# Altium schematic sheet POWER.SchDoc
size A3
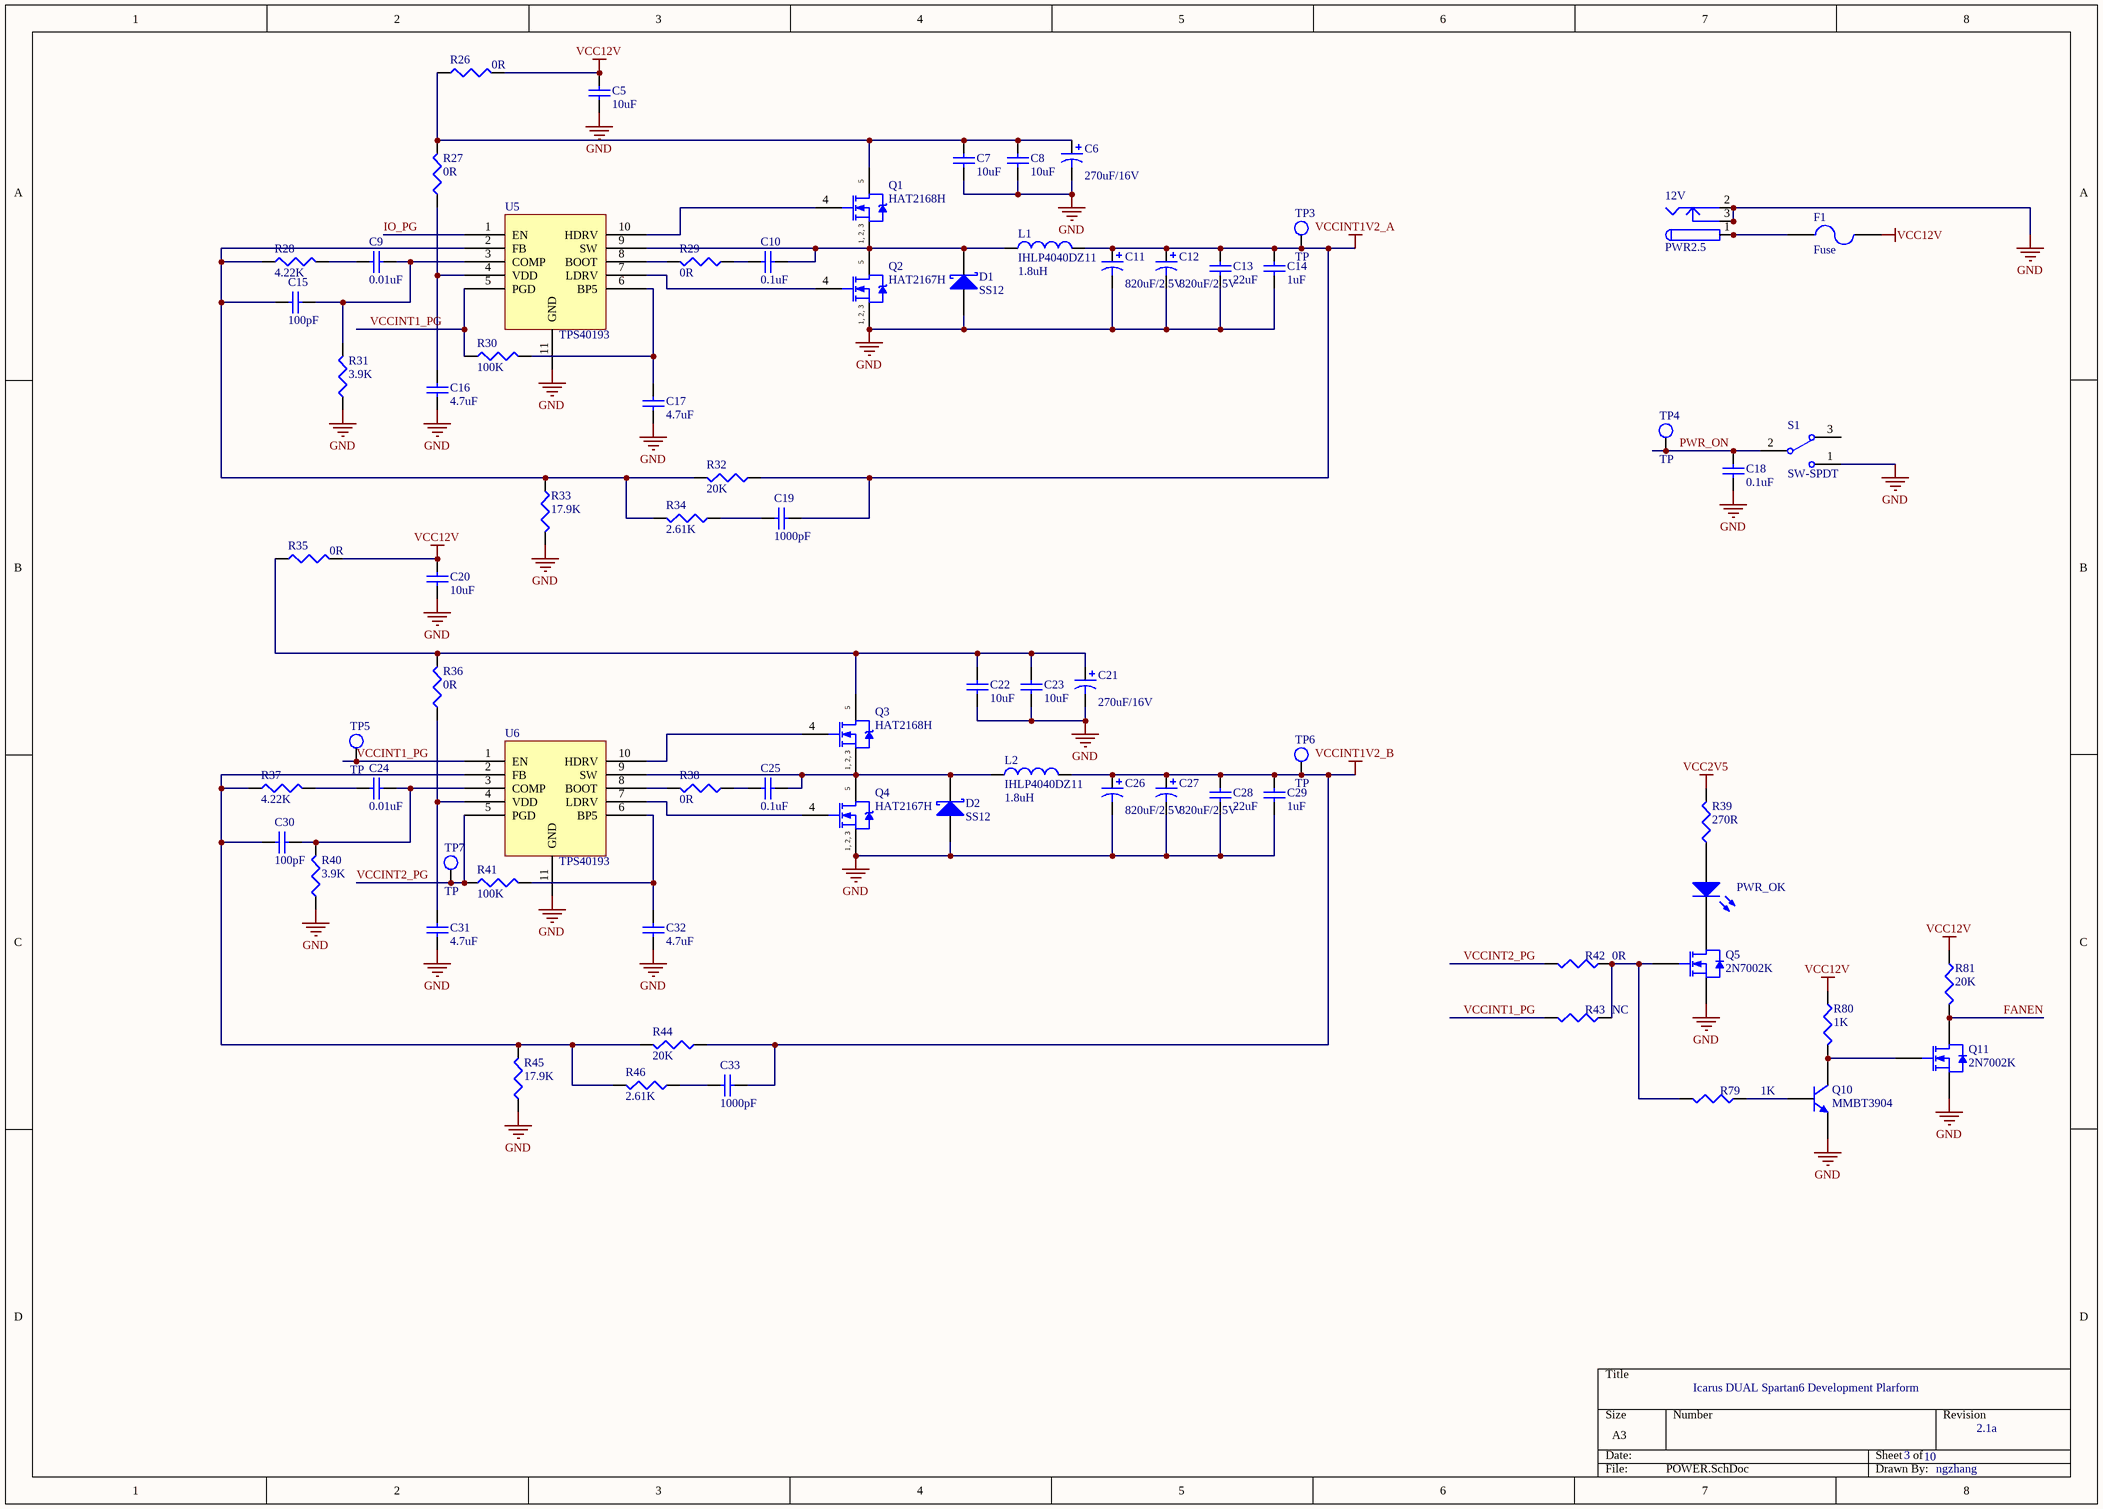
[diagram p0: POWER.SchDoc]

## Parts
12V  PWR2.5  [KLD-0202]
C5  10uF  [C1206]
C6  270uF/16V  [CAP8X8]
C7  10uF  [C1206]
C8  10uF  [C1206]
C9  0.01uF  [1608[0603]]
C10  0.1uF  [1608[0603]]
C11  820uF/2.5V  [CAP8X8]
C12  820uF/2.5V  [CAP8X8]
C13  22uF  [C1206]
C14  1uF  [1608[0603]]
C15  100pF  [1608[0603]]
C16  4.7uF  [C0805]
C17  4.7uF  [C0805]
C18  0.1uF  [1608[0603]]
C19  1000pF  [1608[0603]]
C20  10uF  [C1206]
C21  270uF/16V  [CAP8X8]
C22  10uF  [C1206]
C23  10uF  [C1206]
C24  0.01uF  [1608[0603]]
C25  0.1uF  [1608[0603]]
C26  820uF/2.5V  [CAP8X8]
C27  820uF/2.5V  [CAP8X8]
C28  22uF  [C1206]
C29  1uF  [1608[0603]]
C30  100pF  [1608[0603]]
C31  4.7uF  [C0805]
C32  4.7uF  [C0805]
C33  1000pF  [1608[0603]]
D1  SS12  [SMA]
D2  SS12  [SMA]
F1  Fuse  [12Z-2010]
L1  IHLP4040DZ11  value 1.8uH  [IHLP4040]
L2  IHLP4040DZ11  value 1.8uH  [IHLP4040]
PWR_OK  LED3  [CD1608-0603]  (value not drawn)
Q1  HAT2168H  [LFPAK]
Q2  HAT2167H  [LFPAK]
Q3  HAT2168H  [LFPAK]
Q4  HAT2167H  [LFPAK]
Q5  2N7002K  [SOT23_N]
Q10  MMBT3904  [SOT23_N]
Q11  2N7002K  [SOT23_N]
R26  0R  [C1206]
R27  0R  [J1-0603]
R28  4.22K  [J1-0603]
R29  0R  [J1-0603]
R30  100K  [J1-0603]
R31  3.9K  [J1-0603]
R32  20K  [J1-0603]
R33  17.9K  [J1-0603]
R34  2.61K  [J1-0603]
R35  0R  [C1206]
R36  0R  [J1-0603]
R37  4.22K  [J1-0603]
R38  0R  [J1-0603]
R39  270R  [J1-0603]
R40  3.9K  [J1-0603]
R41  100K  [J1-0603]
R42  0R  [J1-0603]
R43  NC  [J1-0603]
R44  20K  [J1-0603]
R45  17.9K  [J1-0603]
R46  2.61K  [J1-0603]
R79  1K  [J1-0603]
R80  1K  [J1-0603]
R81  20K  [J1-0603]
S1  SW-SPDT  [SW_3]
TP3  TP  [TP]
TP4  TP  [TP]
TP5  TP  [TP]
TP6  TP  [TP]
TP7  TP  [TP]
U5  TPS40193  [SON10]
U6  TPS40193  [SON10]

## Nets
GND: 12V.2 12V.2A 12V.2B 12V.3 12V.3A 12V.3B C5.1 C6.2 C7.1 C8.1 C11.2 C12.2 C13.1 C14.1 C16.2 C17.1 C18.1 C20.1 C21.2 C22.1 C23.1 C26.2 C27.2 C28.1 C29.1 C31.1 C32.2 D1.1(A) D2.1(A) Q2.1(S) Q2.2(S) Q2.3(S) Q4.1(S) Q4.2(S) Q4.3(S) Q5.2(S) Q10.2(E) Q11.2(S) R31.1 R33.2 R40.1 R45.1 S1.1 U5.11(GND) U6.11(GND)
VCC2V5: R39.2
VCC12V: C5.2 C20.2 F1.2 R26.2 R35.2 R80.1 R81.1
VCCINT1V2_A: C11.1 C12.1 C13.2 C14.2 C19.2 L1.2 R32.1 TP3.1(TP)
VCCINT1V2_B: C26.1 C27.1 C28.2 C29.2 C33.2 L2.2 R44.1 TP6.1(TP)
FANEN: Q11.3(D) R81.2
IO_PG: U5.1(EN)
PWR_ON: C18.2 S1.2 TP4.1(TP)
VCCINT1_PG: R30.1 R43.2 TP5.1(TP) U5.5(PGD) U6.1(EN)
VCCINT2_PG: R41.1 R42.2 TP7.1(TP) U6.5(PGD)
Net12V_1: 12V.1 12V.1A 12V.1B F1.1
NetC6_1: C6.1 C7.2 C8.2 Q1.5(D) R26.1 R27.2
NetC9_1: C9.1 C15.1 R31.2 U5.3(COMP)
NetC9_2: C9.2 R28.2
NetC10_1: C10.1 D1.2(K) L1.1 Q1.1(S) Q1.2(S) Q1.3(S) Q2.5(D) U5.9(SW)
NetC10_2: C10.2 R29.1
NetC15_2: C15.2 R28.1 R32.2 R33.1 R34.2 U5.2(FB)
NetC16_1: C16.1 R27.1 U5.4(VDD)
NetC17_2: C17.2 R30.2 U5.6(BP5)
NetC19_1: C19.1 R34.1
NetC21_1: C21.1 C22.2 C23.2 Q3.5(D) R35.1 R36.2
NetC24_1: C24.1 C30.1 R40.2 U6.3(COMP)
NetC24_2: C24.2 R37.2
NetC25_1: C25.1 D2.2(K) L2.1 Q3.1(S) Q3.2(S) Q3.3(S) Q4.5(D) U6.9(SW)
NetC25_2: C25.2 R38.1
NetC30_2: C30.2 R37.1 R44.2 R45.2 R46.2 U6.2(FB)
NetC31_2: C31.2 R36.1 U6.4(VDD)
NetC32_1: C32.1 R41.2 U6.6(BP5)
NetC33_1: C33.1 R46.1
NetPWR_OK_1: PWR_OK.1(A) R39.1
NetPWR_OK_2: PWR_OK.2(K) Q5.3(D)
NetQ1_4: Q1.4(G) U5.10(HDRV)
NetQ2_4: Q2.4(G) U5.7(LDRV)
NetQ3_4: Q3.4(G) U6.10(HDRV)
NetQ4_4: Q4.4(G) U6.7(LDRV)
NetQ5_1: Q5.1(G) R42.1 R43.1 R79.2
NetQ10_1: Q10.1(B) R79.1
NetQ10_3: Q10.3(C) Q11.1(G) R80.2
NetR29_2: R29.2 U5.8(BOOT)
NetR38_2: R38.2 U6.8(BOOT)

Not connected (* = marked no-connect by the designer): S1 3

## Notes on the sheet
- Icarus DUAL Spartan6 Development Plarform
- 3
- 10
- 2.1a
- ngzhang
- (in symbol HAT216X) 1, 2, 3

## Library data of the parts
12V = PWR2.5: Low Voltage Power Supply Connector; Published: 17-Dec-2003; DatasheetDocument: 09-May-2002; Publisher: Altium Limited; ComponentLink1Description: Manufacturer Link; ComponentLink1URL: http://domino.kycon.com/internet/Products.html
C5 C7-C10 C13-C20 C22-C25 C28-C33 = Cap Semi: Capacitor (Semiconductor SIM Model); Published: 8-Jun-2000; LatestRevisionDate: 29-May-2009; LatestRevisionNote: IPC-7351 Footprint Added.; PackageReference: C1206; Publisher: Altium Limited; PackageDescription: Chip Capacitor
  C5 C7 C8 C20 C22 C23: Value: 10uF
  C9 C24: Value: 0.01uF
  C10 C18 C25: Value: 0.1uF
  C13 C28: Value: 22uF
  C14 C29: Value: 1uF
  C15 C30: Value: 100pF
  C16 C17 C31 C32: Value: 4.7uF
  C19 C33: Value: 1000pF
C6 C11 C12 C21 C26 C27 = Cap Pol1: Polarized Capacitor (Radial); Published: 8-Jun-2000; LatestRevisionDate: 17-Jul-2002; LatestRevisionNote: Re-released for DXP Platform.; PackageReference: RB7.6-15; Publisher: Altium Limited; PackageDescription: Polarized Capacitor (Radial); 2 Leads
  C6 C21: Value: 270uF/16V
  C11 C12 C26 C27: Value: 820uF/2.5V
D1 D2 = 10MQ060N: Schottky Rectifier; Published: 17-Sep-2003; DatasheetVersion: May-2002; PackageVersion: revH, May-2002; PackageReference: SMA; Publisher: Altium Limited; PackageDescription: DO-214-AC/SMA; 2 C-Bend Leads; Body 5 x 2.7 mm, inc. leads (LxW); ComponentLink1Description: Manufacturer Link; ComponentLink1URL: http://www.irf.com/; ComponentLink2Description: Datasheet; ComponentLink2URL: http://www.irf.com/product-info/datasheets/data/10MQ060N.pdf
F1 = Fuse 2: Published: 8-Jun-2000; LatestRevisionDate: 17-Jul-2002; LatestRevisionNote: Re-released for DXP Platform.; PackageReference: PIN-W2/E2.8; Publisher: Altium Limited
L1 L2 = Inductor: Code_IEC: 1005; Published: 8-Jun-2000; LatestRevisionDate: 29-May-2009; LatestRevisionNote: IPC-7351 Footprint Added.; PackageReference: 0402-A; Publisher: Altium Limited; PackageDescription: Chip Inductor; Code_JEITA: 0402
PWR_OK = LED3: Typical BLUE SiC LED; Published: 8-Jun-2000; LatestRevisionDate: 17-Dec-2003; LatestRevisionNote: PCB Footprint replaced.; DatasheetVersion: 16-Apr-2002; PackageVersion: 16-Apr-2002; PackageReference: 3.5X2.8X1.9; Publisher: Altium Limited; PackageDescription: SM LED; 2 C-Bend Leads; Body 3.5 x 2.8 x 1.9 mm, inc leads (LxWxH typ)
Q1-Q4 = HAT216X
Q5 Q11 = 2N7002: N-channel Enhancement Mode Field-effect Transistor; Published: 17-Sep-2003; LatestRevisionDate: 12-Dec-2006; LatestRevisionNote: IPC-7351 Footprint Added.; DatasheetVersion: 27-Jul-2000; PackageVersion: May-1999; PackageReference: SOT23; Publisher: Altium Limited; PackageDescription: 3-Pin SOT-23 Package 0.95 mm Pitch, 2.3 mm Lead Span; ComponentLink1Description: Manufacturer Link; ComponentLink1URL: http://www.semiconductors.philips.com/; ComponentLink2Description: Datasheet; ComponentLink2URL: http://www.semiconductors.philips.com/acrobat/datasheets/2N7002_4.pdf
Q10 = MMBT3904: NPN Switching Transistor; Published: 17-Sep-2003; LatestRevisionDate: 12-Dec-2006; LatestRevisionNote: IPC-7351 Footprint Added.; DatasheetVersion: 13-May-2002; PackageVersion: May-1999; PackageReference: SOT23; Publisher: Altium Limited; PackageDescription: 3-Pin SOT-23 Package 0.95 mm Pitch, 2.3 mm Lead Span; ComponentLink1Description: Manufacturer Link; ComponentLink1URL: http://www.semiconductors.philips.com/; ComponentLink2Description: Datasheet; ComponentLink2URL: http://www.semiconductors.philips.com/acrobat/datasheets/MMBT3904_4.pdf
R26-R46 R79-R81 = Res3: Resistor; Published: 8-Jun-2000; LatestRevisionDate: 29-May-2009; LatestRevisionNote: IPC-7351 Footprint Added.; PackageReference: J1-0603; Publisher: Altium Limited; PackageDescription: Chip Resistor
  R26 R27 R29 R35 R36 R38 R42: Value: 0R
  R28 R37: Value: 4.22K
  R30 R41: Value: 100K
  R31 R40: Value: 3.9K
  R32 R44 R81: Value: 20K
  R33 R45: Value: 17.9K
  R34 R46: Value: 2.61K
  R39: Value: 270R
  R43: Value: NC
  R79 R80: Value: 1K
S1 = SW-SPDT: SPDT Subminiature Toggle Switch, Right Angle Mounting, Vertical Actuation; Published: 24-Mar-1999; LatestRevisionDate: 17-Dec-2003; LatestRevisionNote: Schematic revised, PCB Footprint replaced.; DatasheetVersion: 05-Dec-2000; PackageReference: TL36WW15050; Publisher: Altium Limited; PackageDescription: Switch; 4 Leads; ComponentLink1Description: Manufacturer Link; ComponentLink1URL: http://www.apem.com